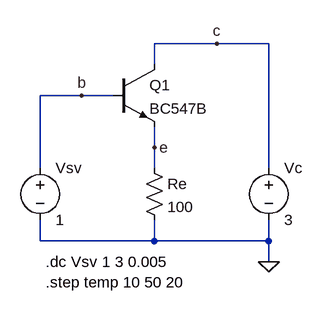
[diagram p0: schematic current_source.asc]
current_source.asc, the LTspice schematic file:
Version 4
SHEET 1 880 680
WIRE 304 -16 208 -16
WIRE 384 -16 304 -16
WIRE 208 16 208 -16
WIRE 96 64 32 64
WIRE 144 64 96 64
WIRE 208 144 208 112
WIRE 32 176 32 64
WIRE 208 176 208 144
WIRE 384 176 384 -16
WIRE 32 288 32 256
WIRE 208 288 208 256
WIRE 208 288 32 288
WIRE 384 288 384 256
WIRE 384 288 208 288
WIRE 384 320 384 288
FLAG 96 64 b
FLAG 304 -16 c
FLAG 208 144 e
FLAG 384 320 0
SYMBOL npn 144 16 R0
SYMATTR InstName Q1
SYMATTR Value BC547B
SYMBOL res 192 160 R0
SYMATTR InstName Re
SYMATTR Value 100
SYMBOL voltage 32 160 R0
SYMATTR InstName Vsv
SYMATTR Value 1
SYMBOL voltage 384 160 R0
SYMATTR InstName Vc
SYMATTR Value 3
TEXT 40 320 Left 2 !.dc Vsv 1 3 0.005
TEXT 40 352 Left 2 !.step temp 10 50 20

The netlist it stands for:
* current_source.asc
Q1 c b e 0 BC547B
Re e 0 100
Vsv b 0 1
Vc c 0 3
.model NPN NPN
.model PNP PNP
.lib standard.bjt
.dc Vsv 1 3 0.005
.step temp 10 50 20
.backanno
.end